# Altium schematic sheet Wireless.SchDoc
size A4; SheetNumber: 6; SheetTotal: 6
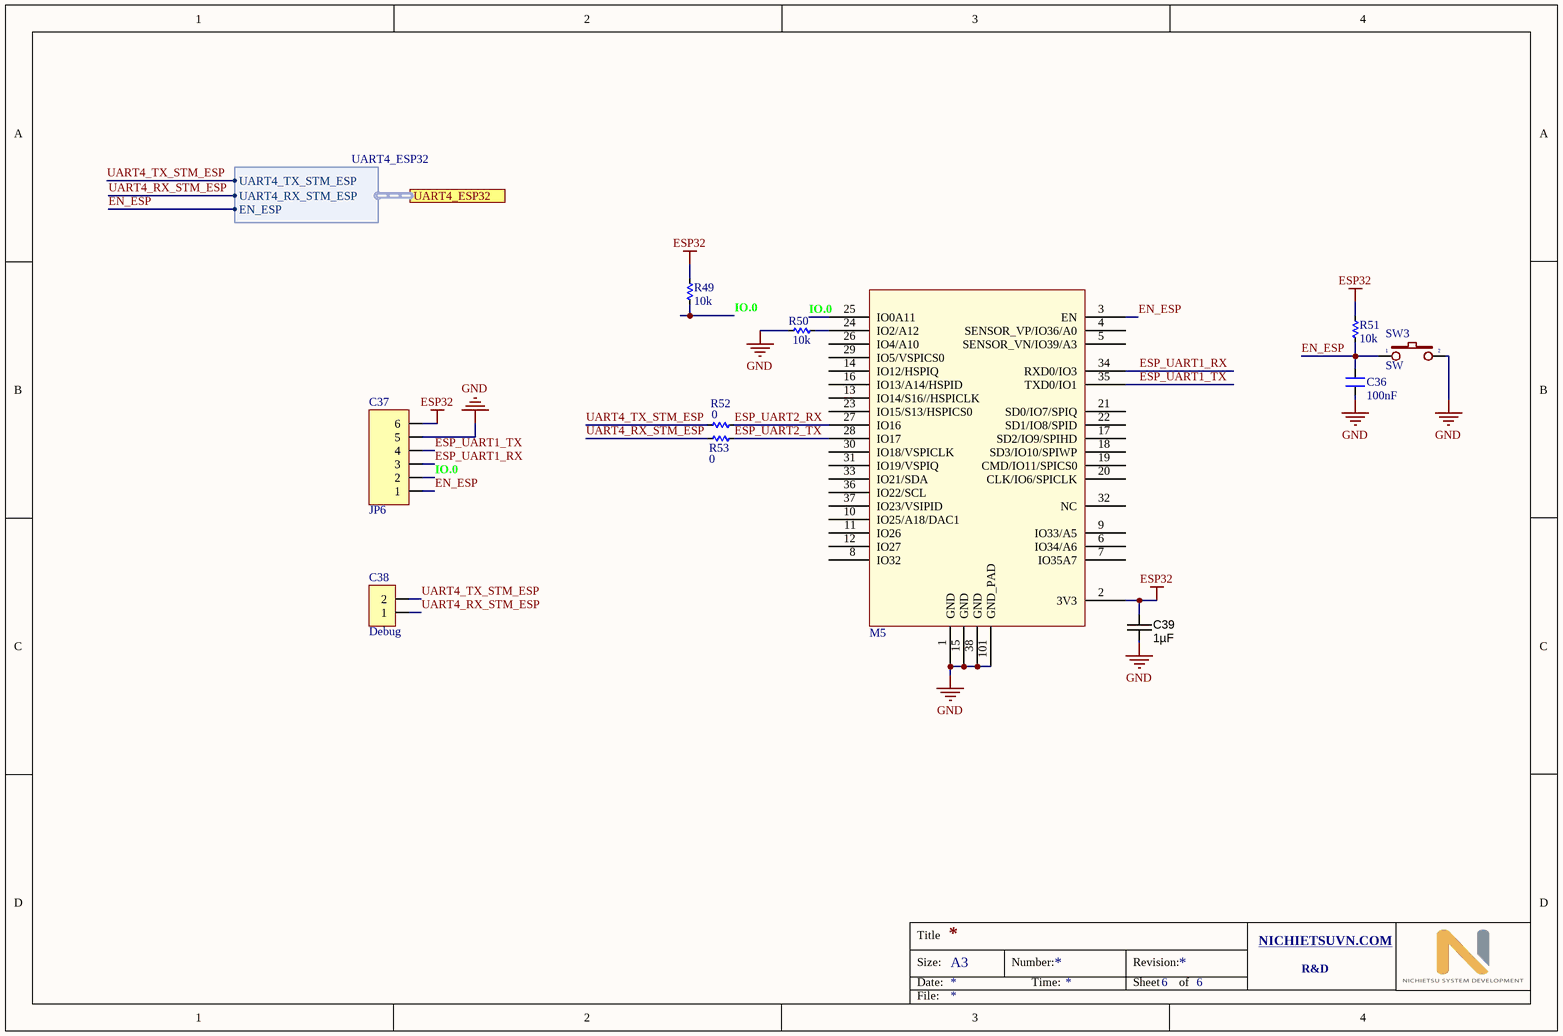
[diagram p0: Wireless.SchDoc]

## Parts
C36  100nF  [CN-SMD-0603]
C37  JP6  [JP6-D1T]
C38  Debug  [JP2-CLOSED]
C39  1µF  [CAPC1608X90N]
M5  ESP32S_Module  [ESP32S]  (value not drawn)
R49  10k  [RES-SMD-0603]
R50  10k  [RES-SMD-0603]
R51  10k  [RES-SMD-0603]
R52  0  [RES-SMD-0603]
R53  0  [RES-SMD-0603]
SW3  SW  [SW1-SMD]

## Ports
UART4_ESP32 (harness UART4_ESP32)

## Harnesses
UART4_ESP32: UART4_TX_STM_ESP, UART4_RX_STM_ESP, EN_ESP

## Nets
ESP32: C37.6 C39.1 M5.2(3V3) R49.1 R51.1
GND: C36.2 C37.5 C39.2 M5.1(GND) M5.15(GND) M5.38(GND) M5.101(GND_PAD) R50.1 SW3.2
EN_ESP: C36.1 C37.1 M5.3(EN) R51.2 SW3.1 ; port UART4_ESP32.EN_ESP
ESP_UART1_RX: C37.3 M5.34(RXD0/IO3)
ESP_UART1_TX: C37.4 M5.35(TXD0/IO1)
ESP_UART2_RX: M5.27(IO16) R52.1
ESP_UART2_TX: M5.28(IO17) R53.1
IO.0: C37.2 M5.25(IO0A11) R49.2
UART4_RX_STM_ESP: C38.1 R53.2 ; port UART4_ESP32.UART4_RX_STM_ESP
UART4_TX_STM_ESP: C38.2 R52.2 ; port UART4_ESP32.UART4_TX_STM_ESP
NetM5_24: M5.24(IO2/A12) R50.2

Not connected (* = marked no-connect by the designer): M5 4(SENSOR_VP/IO36/A0) 5(SENSOR_VN/IO39/A3) 6(IO34/A6) 7(IO35A7) 8(IO32) 9(IO33/A5) 10(IO25/A18/DAC1) 11(IO26) 12(IO27) 13(IO14/S16//HSPICLK) 14(IO12/HSPIQ) 16(IO13/A14/HSPID) 17(SD2/IO9/SPIHD) 18(SD3/IO10/SPIWP) 19(CMD/IO11/SPICS0) 20(CLK/IO6/SPICLK) 21(SD0/IO7/SPIQ) 22(SD1/IO8/SPID) 23(IO15/S13/HSPICS0) 26(IO4/A10) 29(IO5/VSPICS0) 30(IO18/VSPICLK) 31(IO19/VSPIQ) 32(NC) 33(IO21/SDA) 36(IO22/SCL) 37(IO23/VSIPID)

## Notes on the sheet
- Title
- Size:
- Date:
- A3
- Number:
- Time:
- Revision:
- Sheet
- of
- NICHIETSUVN.COM <http://NICHIETSUVN.COM>
- R&D
- File:

## Library data of the parts
C36 = CN: Value: 33pF
C37 = JP6: WR-PHD 2.54 mm Angled Socket Header; Manufacturer: W¨¹rth Elektronik eiSos GmbH; partNo: 613006143121; ComponentLink1 Description: Manufacturer; ComponentLink2 Description: Datasheet; NoPins: 06; Created Date: 29 March 2013; ComponentLink1URL: http://www.we-online.com; ComponentLink2URL: http://katalog.we-online.de/em/datasheet/6130xx143121.pdf; Created by: Karrer Zheng
C38 = JP2: WR-PHD 2.54 mm Angled Socket Header; Manufacturer: W¨¹rth Elektronik eiSos GmbH; partNo: 613002143121; ComponentLink1 Description: Manufacturer; ComponentLink2 Description: Datasheet; NoPins: 02; Created Date: 29 March 2013; ComponentLink1URL: http://www.we-online.com; ComponentLink2URL: http://katalog.we-online.de/em/datasheet/6130xx143121.pdf; Created by: Karrer Zheng
C39 = CAPC_1uF_0603_X7R_35V_10%: 1µF ±10% 16V Ceramic Capacitor X7R 0603 (1608 Metric); Manufacturer 1: Taiyo Yuden; Manufacturer Part Number 1: GMK107AB7105KAHT; Voltage - Rated: 35V; Pcs 2: 10; Tolerance: ±10%; Operating Temperature: -55°C ~ 125°C; Package / Case: 0603 (1608 Metric); Temperature Coefficient: X7R; Ratings: AEC-Q200; Applications: Automotive; Packaging: Digi-Reel®; Supplier 1: Digi-Key; Supplier Part Number 1: 587-3352-6-ND; Supplier 2: http://www.tme.vn; Supplier Part Number 2: http://www.tme.vn/Product.aspx?id=728#page=pro_info; Price 2: 1800; Value: 1µF
M5 = ESP32S_Module: Esp-32S; Datasheet: https://espressif.com/sites/default/files/documentation/esp_wroom_32_datasheet_en.pdf
R49-R53 = Res-SMD: Resistor; Manufacturer: Generic Components; Class: Passive; Published: 08/06/2000; Publisher: Altium Hobart Technology Centre
SW3 = SW2: Switch button 2 pin; Value: SW chip 2 pin